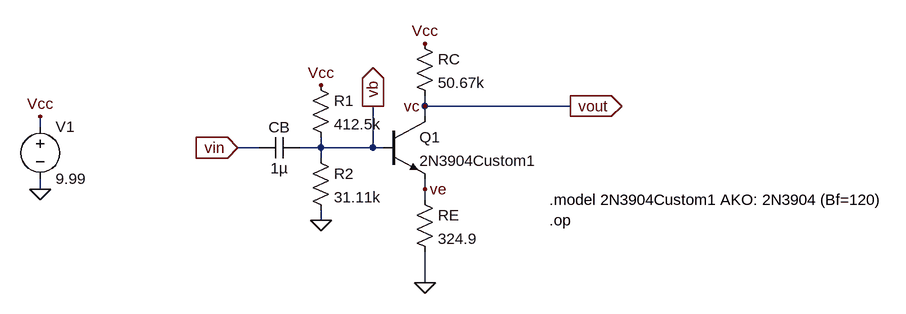
[diagram p0: schematic stage1.asc]
stage1.asc, the LTspice schematic file:
Version 4
SHEET 1 1252 680
WIRE 528 160 528 144
WIRE 752 160 528 160
WIRE 528 176 528 160
WIRE -64 192 -64 176
WIRE 272 224 240 224
WIRE 368 224 368 208
WIRE 368 224 336 224
WIRE 448 224 448 160
WIRE 448 224 368 224
WIRE 464 224 448 224
WIRE 368 240 368 224
WIRE -64 288 -64 272
WIRE 528 288 528 272
WIRE 528 304 528 288
WIRE 368 336 368 320
WIRE 528 432 528 384
FLAG 368 336 0
FLAG 240 224 vin
IOPIN 240 224 In
FLAG 448 160 vb
IOPIN 448 160 Out
FLAG 528 160 vc
FLAG 368 128 Vcc
FLAG 528 64 Vcc
FLAG 752 160 vout
IOPIN 752 160 Out
FLAG 528 432 0
FLAG -64 288 0
FLAG -64 176 Vcc
FLAG 528 288 ve
SYMBOL Res 352 112 R0
SYMATTR InstName R1
SYMATTR Value 412.5k
SYMBOL Res 352 224 R0
SYMATTR InstName R2
SYMATTR Value 31.11k
SYMBOL Cap 336 208 R90
WINDOW 0 0 32 VBottom 2
WINDOW 3 32 32 VTop 2
SYMATTR InstName CB
SYMATTR Value 1µ
SYMBOL Res 512 48 R0
SYMATTR InstName RC
SYMATTR Value 50.67k
SYMBOL Res 512 288 R0
SYMATTR InstName RE
SYMATTR Value 324.9
SYMBOL Voltage -64 176 R0
SYMATTR InstName V1
SYMATTR Value 9.99
SYMBOL npn 464 176 R0
SYMATTR InstName Q1
SYMATTR Value 2N3904Custom1
TEXT 720 304 Left 2 !.model 2N3904Custom1 AKO: 2N3904 (Bf=120)
TEXT 720 336 Left 2 !.op

The netlist it stands for:
* stage1.asc
R1 Vcc vb 412.5k
R2 vb 0 31.11k
CB vb vin 1µ
RC Vcc vout 50.67k
RE ve 0 324.9
V1 Vcc 0 9.99
Q1 vout vb ve 0 2N3904Custom1
.model NPN NPN
.model PNP PNP
.lib standard.bjt
.model 2N3904Custom1 AKO: 2N3904 (Bf=120)
.op
.backanno
.end